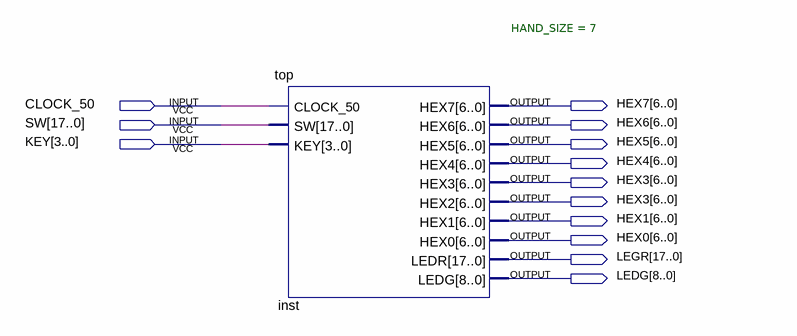
[diagram p0: schematic sheet]
// Quartus schematic Uno.bdf as structural Verilog: 1 symbols, 13 pins
module Uno (
  input  CLOCK_50,
  input  [17:0] SW,
  input  [3:0] KEY,
  output [6:0] HEX7,
  output [6:0] HEX6,
  output [6:0] HEX5,
  output [6:0] HEX4,
  output [6:0] HEX3,
  output [6:0] HEX1,
  output [6:0] HEX0,
  output [17:0] LEGR,
  output [8:0] LEDG
);

  top #(.HAND_SIZE(7)) inst (
    .CLOCK_50(CLOCK_50), .SW(SW), .KEY(KEY), .HEX7(HEX7), .HEX6(HEX6), .HEX5(HEX5), .HEX4(HEX4), .HEX3(HEX3),
    .HEX2(HEX3), .HEX1(HEX1), .HEX0(HEX0), .LEDR(LEGR), .LEDG(LEDG));
endmodule
